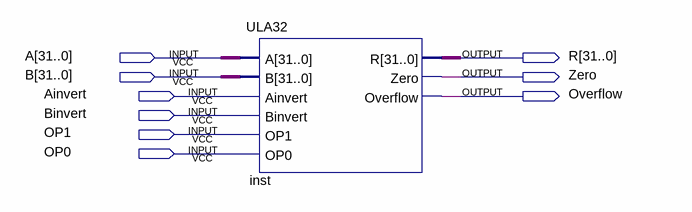
[diagram p0: schematic sheet]
// Quartus schematic teste_ula.bdf as structural Verilog: 1 symbols, 9 pins
module teste_ula (
  input  [31:0] A,
  input  [31:0] B,
  input  Ainvert,
  input  Binvert,
  input  OP1,
  input  OP0,
  output [31:0] R,
  output Zero,
  output Overflow
);

  ULA32 inst (
    .A(A), .B(B), .Ainvert(Ainvert), .Binvert(Binvert), .OP1(OP1), .OP0(OP0), .R(R), .Zero(Zero),
    .Overflow(Overflow));
endmodule
